# Altium schematic sheet Gagabiro_POC_PSU_main.SchDoc
size 393 x 281 mm; SheetNumber: 1; SheetTotal: 1
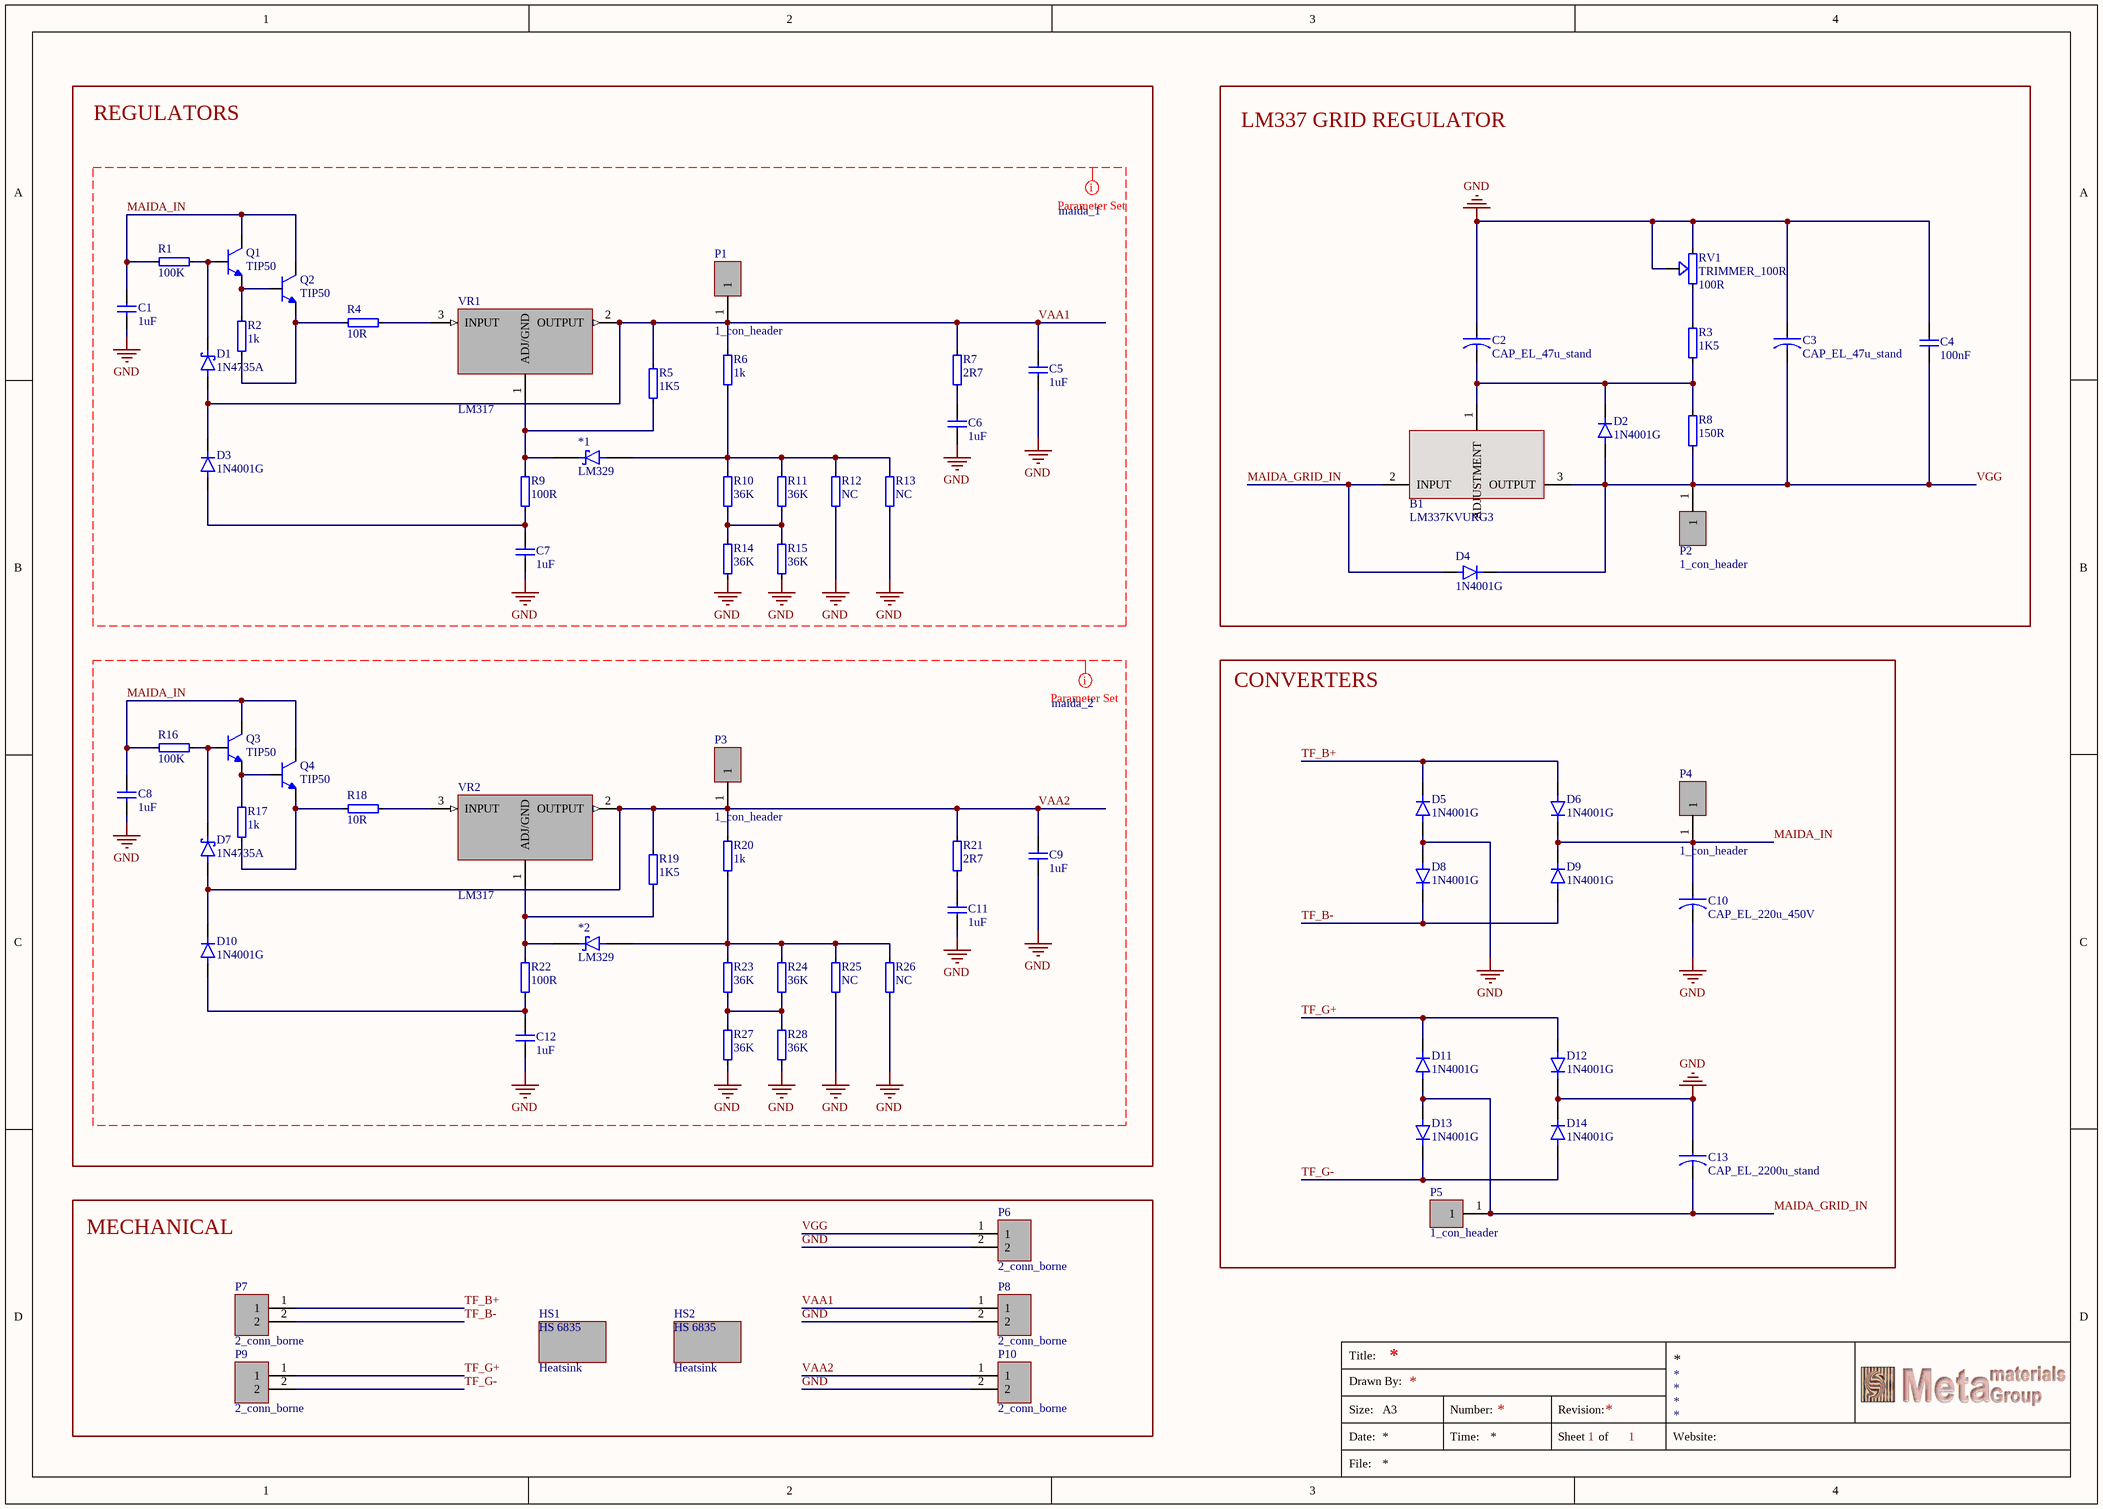
[diagram p0: Gagabiro_POC_PSU_main.SchDoc]

## Parts
*1  LM329  [TO92127P495H495-3]
*2  LM329  [TO92127P495H495-3]
B1  LM337KVURG3  [lm317]
C1  1uF  [CAP_panassonic_1u_450V]
C2  CAP_EL_47u_stand  [CAPPRD500W50D630H1120_stand]
C3  CAP_EL_47u_stand  [CAPPRD500W50D630H1120_stand]
C4  100nF  [CAP_panassonic_100n_450V]
C5  1uF  [CAP_panassonic_1u_450V]
C6  1uF  [CAP_panassonic_1u_450V]
C7  1uF  [CAP_panassonic_1u_450V]
C8  1uF  [CAP_panassonic_1u_450V]
C9  1uF  [CAP_panassonic_1u_450V]
C10  CAP_EL_220u_450V  [CAPPRD500W50D630H1120_stand_25x50]
C11  1uF  [CAP_panassonic_1u_450V]
C12  1uF  [CAP_panassonic_1u_450V]
C13  CAP_EL_2200u_stand  [CAPPRD500W50D630H1120_stand_22x40]
D1  1N4735A  [DIOAD1036W78L463D272]
D2  1N4001G  [DIOAD1036W78L470D235]
D3  1N4001G  [DIOAD1036W78L470D235]
D4  1N4001G  [DIOAD1036W78L470D235]
D5  1N4001G  [DIOAD1036W78L470D235]
D6  1N4001G  [DIOAD1036W78L470D235]
D7  1N4735A  [DIOAD1036W78L463D272]
D8  1N4001G  [DIOAD1036W78L470D235]
D9  1N4001G  [DIOAD1036W78L470D235]
D10  1N4001G  [DIOAD1036W78L470D235]
D11  1N4001G  [DIOAD1036W78L470D235]
D12  1N4001G  [DIOAD1036W78L470D235]
D13  1N4001G  [DIOAD1036W78L470D235]
D14  1N4001G  [DIOAD1036W78L470D235]
HS1  Heatsink  [heatsink_HS_6835]
HS2  Heatsink  [heatsink_HS_6835]
P1  1_con_header  [SAMTEC_MTMM-101-X-X-S-X]
P2  1_con_header  [SAMTEC_MTMM-101-X-X-S-X]
P3  1_con_header  [SAMTEC_MTMM-101-X-X-S-X]
P4  1_con_header  [SAMTEC_MTMM-101-X-X-S-X]
P5  1_con_header  [SAMTEC_MTMM-101-X-X-S-X]
P6  2_conn_borne  [691101710002]
P7  2_conn_borne  [691101710002]
P8  2_conn_borne  [691101710002]
P9  2_conn_borne  [691101710002]
P10  2_conn_borne  [691101710002]
Q1  TIP50  [TO254P1009X445X1985-3]
Q2  TIP50  [TO254P1009X445X1985-3]
Q3  TIP50  [TO254P1009X445X1985-3]
Q4  TIP50  [TO254P1009X445X1985-3]
R1  100K  [RES_2W_vertical]
R2  1k  [RES_2W_vertical]
R3  1K5  [RES_2W_vertical]
R4  10R  [RES_2W_vertical]
R5  1K5  [RES_2W_vertical]
R6  1k  [RES_2W_vertical]
R7  2R7  [RES_2W_vertical]
R8  150R  [RES_2W_vertical]
R9  100R  [RES_2W_vertical]
R10  36K  [RES_2W_vertical]
R11  36K  [RES_2W_vertical]
R12  NC  [RES_2W_vertical]
R13  NC  [RES_2W_vertical]
R14  36K  [RES_2W_vertical]
R15  36K  [RES_2W_vertical]
R16  100K  [RES_2W_vertical]
R17  1k  [RES_2W_vertical]
R18  10R  [RES_2W_vertical]
R19  1K5  [RES_2W_vertical]
R20  1k  [RES_2W_vertical]
R21  2R7  [RES_2W_vertical]
R22  100R  [RES_2W_vertical]
R23  36K  [RES_2W_vertical]
R24  36K  [RES_2W_vertical]
R25  NC  [RES_2W_vertical]
R26  NC  [RES_2W_vertical]
R27  36K  [RES_2W_vertical]
R28  36K  [RES_2W_vertical]
RV1  TRIMMER_100R  value 100R  [TRIM_PV36W204C01B00 - duplicate]
VR1  LM317  [TO254P1009X445X1985-3]
VR2  LM317  [TO254P1009X445X1985-3]

## Blocks framed on the sheet
REGULATORS: *1 *2 C1 C5-C9 C11 C12 D1 D3 D7 D10 P1 P3 Q1-Q4 R1 R2 R4-R7 R9-R28 VR1 VR2
LM337 GRID REGULATOR: B1 C2-C4 D2 D4 P2 R3 R8 RV1
CONVERTERS: C10 C13 D5 D6 D8 D9 D11-D14 P4 P5
MECHANICAL: HS1 HS2 P6-P10

## Nets
GND: C1.1 C2.P C3.P C4.2 C5.1 C6.1 C7.1 C8.1 C9.1 C10.N C11.1 C12.1 C13.P D5.A D8.A D12.C(K) D14.C(K) P6.2 P8.2 P10.2 R12.1 R13.1 R14.1 R15.1 R25.1 R26.1 R27.1 R28.1 RV1.2 RV1.3
MAIDA_GRID_IN: B1.2(INPUT) C13.N D4.A D11.A D13.A P5.1
MAIDA_IN: C1.2 C8.2 C10.P D6.C(K) D9.C(K) P4.1 Q1.2(C) Q2.2(C) Q3.2(C) Q4.2(C) R1.1 R16.1
TF_B+: D5.C(K) D6.A P7.1
TF_B-: D8.C(K) D9.A P7.2
TF_G+: D11.C(K) D12.A P9.1
TF_G-: D13.C(K) D14.A P9.2
VAA1: C5.2 D1.2(A) D3.C(K) P1.1 P8.1 R5.1 R6.2 R7.2 VR1.2(OUTPUT)
VAA2: C9.2 D7.2(A) D10.C(K) P3.1 P10.1 R19.1 R20.2 R21.2 VR2.2(OUTPUT)
VGG: B1.3(OUTPUT) C3.N C4.1 D2.A D4.C(K) P2.1 P6.1 R8.1
Net*1_2: *1.2 R5.2 R9.2 VR1.1(ADJ/GND)
Net*1_3: *1.3 R6.1 R10.2 R11.2 R12.2 R13.2
Net*2_2: *2.2 R19.2 R22.2 VR2.1(ADJ/GND)
Net*2_3: *2.3 R20.1 R23.2 R24.2 R25.2 R26.2
NetB1_1: B1.1(ADJUSTMENT) C2.N D2.C(K) R3.1 R8.2
NetC6_2: C6.2 R7.1
NetC7_2: C7.2 D3.A R9.1
NetC11_2: C11.2 R21.1
NetC12_2: C12.2 D10.A R22.1
NetD1_1: D1.1(K) Q1.1(B) R1.2
NetD7_1: D7.1(K) Q3.1(B) R16.2
NetQ1_3: Q1.3(E) Q2.1(B) R2.2
NetQ2_3: Q2.3(E) R2.1 R4.1
NetQ3_3: Q3.3(E) Q4.1(B) R17.2
NetQ4_3: Q4.3(E) R17.1 R18.1
NetR3_2: R3.2 RV1.1
NetR4_2: R4.2 VR1.3(INPUT)
NetR10_1: R10.1 R11.1 R14.2 R15.2
NetR18_2: R18.2 VR2.3(INPUT)
NetR23_1: R23.1 R24.1 R27.2 R28.2

## Layout directives
CompClassName: maida_2: GND, MAIDA_IN, VAA2
CompClassName: maida_1: GND, MAIDA_IN, VAA1

## Notes on the sheet
- Title:
- Drawn By:
- Size:
- Date:
- File:
- A3
- Number:
- Time:
- Revision:
- Sheet
- of
- Website:

## Library data of the parts
B1 = LM337: 3 Pin 1.5A Adjustable Negative Voltage Regulator; Manufacturer_Name: Texas Instruments; Geometry.Height: 2.65mm; Mouser Part Number: 595-LM337KVURG3; Mouser Price/Stock: https://www.mouser.co.uk/ProductDetail/Texas-Instruments/LM337KVURG3?qs=iSMark9AYDXYOGB3Dr0rVg%3D%3D; Manufacturer_Part_Number: LM337KVURG3; Datasheet Link: http://www.ti.com/lit/gpn/lm337
C1 C5-C9 C11 C12 = CAP_POLY_1u: Capacitor, Silver Mica; Part Number: CMICA_47PF; Value: 1uF
C2 C3 = CAP_EL_47u_stand: 220F 16V Aluminum Electrolytic Capacitors Radial, Can 1000 Hrs @ 105C; MP: EEU-HD1C221B; Value: 47uF; MF: Panasonic; Availability: In Stock; Purchase-URL: https://pricing.snapeda.com/search/part/EEU-HD1C221B/?ref=eda; Package: RADIAL-2 Panasonic; Check_prices: https://www.snapeda.com/parts/EEU-HD1C221B/Panasonic/view-part/?ref=eda; SnapEDA_Link: https://www.snapeda.com/parts/EEU-HD1C221B/Panasonic/view-part/?ref=snap; Price: None
C4 = CAP_POLY_100n: Capacitor, Silver Mica; Part Number: CMICA_47PF; Value: 100nF
C10 = CAP_EL_220u_450V: 220F 16V Aluminum Electrolytic Capacitors Radial, Can 1000 Hrs @ 105C; MP: EEU-HD1C221B; Value: 220uF; MF: Panasonic; Availability: In Stock; Purchase-URL: https://pricing.snapeda.com/search/part/EEU-HD1C221B/?ref=eda; Package: RADIAL-2 Panasonic; Check_prices: https://www.snapeda.com/parts/EEU-HD1C221B/Panasonic/view-part/?ref=eda; SnapEDA_Link: https://www.snapeda.com/parts/EEU-HD1C221B/Panasonic/view-part/?ref=snap; Price: None
C13 = CAP_EL_2200u_stand: 220F 16V Aluminum Electrolytic Capacitors Radial, Can 1000 Hrs @ 105C; MP: EEU-HD1C221B; Value: 2200uF; MF: Panasonic; Availability: In Stock; Purchase-URL: https://pricing.snapeda.com/search/part/EEU-HD1C221B/?ref=eda; Package: RADIAL-2 Panasonic; Check_prices: https://www.snapeda.com/parts/EEU-HD1C221B/Panasonic/view-part/?ref=eda; SnapEDA_Link: https://www.snapeda.com/parts/EEU-HD1C221B/Panasonic/view-part/?ref=snap; Price: None
D1 D7 = 1N4735A: Zener Diode 6.2V 1W Â±5% Through Hole DO-204AL (DO-41); MF: ON Semiconductor; SnapEDA_Link: https://www.snapeda.com/parts/1N4735A/Onsemi/view-part/?ref=snap; Package: DO-41 ON Semiconductor; Value: *; MP: 1N4735A; Check_prices: https://www.snapeda.com/parts/1N4735A/Onsemi/view-part/?ref=eda
D2-D6 D8-D14 = 1N4001G: 1A, 50V, Standard Recovery Rectifier; MF: Taiwan Semiconductor; Package: DO-41-2 Taiwan Semiconductor; Check_prices: https://www.snapeda.com/parts/1N4001G/Taiwan+Semiconductor/view-part/?ref=eda; Value: *; Price: None; MP: 1N4001G; Purchase-URL: https://pricing.snapeda.com/search/part/1N4001G/?ref=eda; SnapEDA_Link: https://www.snapeda.com/parts/1N4001G/Taiwan+Semiconductor/view-part/?ref=snap; Availability: In Stock
HS1 HS2 = HS 6835
P1-P5 = 1_con_header: Connector Header Surface Mount, Right Angle 2 position 0.079 (2.00mm); MP: S2B-PH-SM4-TB; MF: JST Sales; Price: None; Availability: In Stock; Package: None; Value: *; SnapEDA_Link: https://www.snapeda.com/parts/S2B-PH-SM4-TB/JST+Sales+America+Inc./view-part/?ref=snap; Purchase-URL: https://pricing.snapeda.com/search/part/S2B-PH-SM4-TB/?ref=eda; Check_prices: https://www.snapeda.com/parts/S2B-PH-SM4-TB/JST+Sales+America+Inc./view-part/?ref=eda
P6-P10 = 2_conn_borne: Connector Header Surface Mount, Right Angle 2 position 0.079 (2.00mm); MP: S2B-PH-SM4-TB; MF: JST Sales; Price: None; Availability: In Stock; Package: None; Value: *; SnapEDA_Link: https://www.snapeda.com/parts/S2B-PH-SM4-TB/JST+Sales+America+Inc./view-part/?ref=snap; Purchase-URL: https://pricing.snapeda.com/search/part/S2B-PH-SM4-TB/?ref=eda; Check_prices: https://www.snapeda.com/parts/S2B-PH-SM4-TB/JST+Sales+America+Inc./view-part/?ref=eda
Q1-Q4 = TIP50: Bipolar (BJT) Transistor NPN 400 V 1 A 10MHz 2 W Through Hole TO-220-3; MF: ON Semiconductor; Price: None; SnapEDA_Link: https://www.snapeda.com/parts/TIP50/Onsemi/view-part/?ref=snap; Availability: In Stock; Value: *; MP: TIP50; Purchase-URL: https://pricing.snapeda.com/search/part/TIP50/?ref=eda; Package: TO-220-3 onsemi; Check_prices: https://www.snapeda.com/parts/TIP50/Onsemi/view-part/?ref=eda
R1 R16 = R_2W_vertical_100K: Resistor, 2W; Part Number: R2W; ComponentLink1URL: N.A.; ComponentLink1Description: Datasheet; ComponentLink2URL: N.A.; ComponentLink2Description: Supplier link; Author: colombari; Value: 100K
R2 R6 R17 R20 = R_2W_vertical_1k: Resistor, 2W; Part Number: R2W; ComponentLink1URL: N.A.; ComponentLink1Description: Datasheet; ComponentLink2URL: N.A.; ComponentLink2Description: Supplier link; Author: colombari; Value: 1k
R3 R5 R19 = R_2W_vertical_1K5: Resistor, 2W; Part Number: R2W; ComponentLink1URL: N.A.; ComponentLink1Description: Datasheet; ComponentLink2URL: N.A.; ComponentLink2Description: Supplier link; Author: colombari; Value: 1K5
R4 R18 = R_2W_vertical_10R: Resistor, 2W; Part Number: R2W; ComponentLink1URL: N.A.; ComponentLink1Description: Datasheet; ComponentLink2URL: N.A.; ComponentLink2Description: Supplier link; Author: colombari; Value: 10R
R7 R21 = R_2W_vertical_2R7: Resistor, 2W; Part Number: R2W; ComponentLink1URL: N.A.; ComponentLink1Description: Datasheet; ComponentLink2URL: N.A.; ComponentLink2Description: Supplier link; Author: colombari; Value: 2R7
R8 = R_2W_vertical_150R: Resistor, 2W; Part Number: R2W; ComponentLink1URL: N.A.; ComponentLink1Description: Datasheet; ComponentLink2URL: N.A.; ComponentLink2Description: Supplier link; Author: colombari; Value: 150R
R9 R22 = R_2W_vertical_100R: Resistor, 2W; Part Number: R2W; ComponentLink1URL: N.A.; ComponentLink1Description: Datasheet; ComponentLink2URL: N.A.; ComponentLink2Description: Supplier link; Author: colombari; Value: 100R
R10 R11 R14 R15 R23 R24 R27 R28 = R_2W_vertical_36K: Resistor, 2W; Part Number: R2W; ComponentLink1URL: N.A.; ComponentLink1Description: Datasheet; ComponentLink2URL: N.A.; ComponentLink2Description: Supplier link; Author: colombari; Value: 36K
R12 R13 R25 R26 = R_2W_vertical_NC: Resistor, 2W; Part Number: R2W; ComponentLink1URL: N.A.; ComponentLink1Description: Datasheet; ComponentLink2URL: N.A.; ComponentLink2Description: Supplier link; Author: colombari; Value: NC
RV1 = TRIMMER_100R: TRIMMER; MF: Bourns Electronics; MP: PV36W204C01B00.; SnapEDA_Link: https://www.snapeda.com/parts/PV36W204C01B00./Bourns/view-part/?ref=snap; Package: None; Check_prices: https://www.snapeda.com/parts/PV36W204C01B00./Bourns/view-part/?ref=eda
VR1 VR2 = LM317: MP: LM317AMDT/NOPB; Package: None; Price: None; Availability: Unavailable; Value: *